# EAGLE design ShieldValvesSensor-v0 (EAGLE 9.6.2)
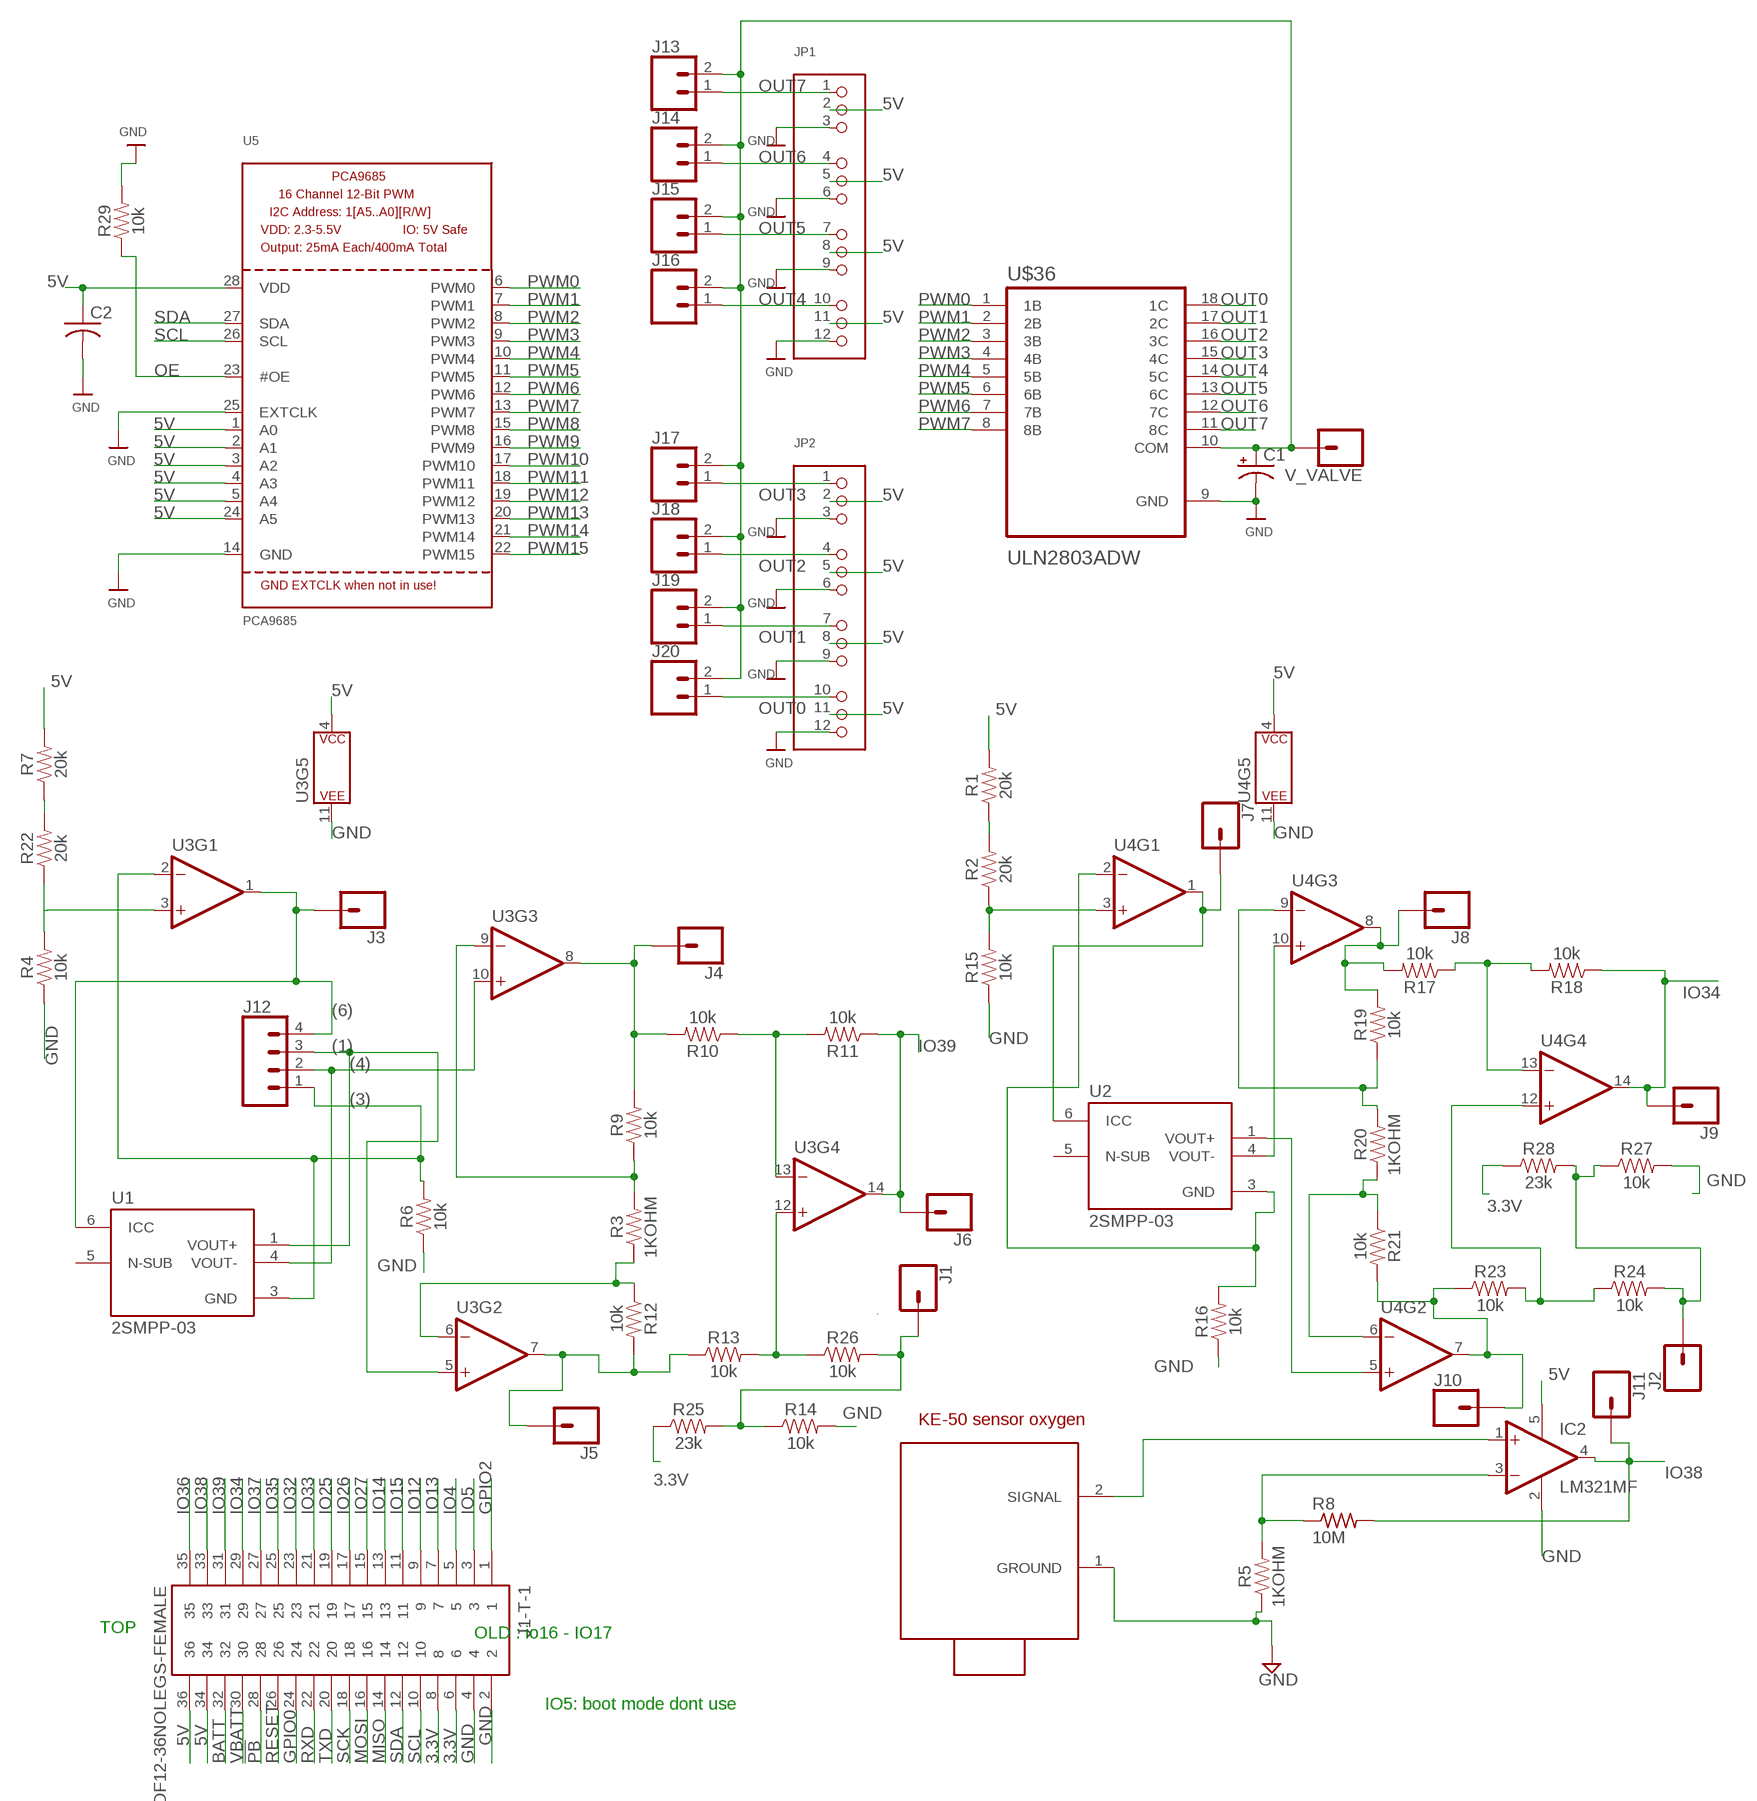
[diagram p0: schematic, sheet 1]

## Parts
C1  CPOL-USE2-4  [E2-4]
C2  C-USC0402  [C0402]
IC2  LM321MF  [SOT23-5]
J1  CONN_01  [1X01]
J1-T-1  DF12-36NOLEGS-FEMALE  [DF12-36-DP-NL]
J2  CONN_01  [1X01]
J3  CONN_01  [1X01]
J4  CONN_01  [1X01]
J5  CONN_01  [1X01]
J6  CONN_01  [1X01]
J7  CONN_01  [1X01]
J8  CONN_01  [1X01]
J9  CONN_01  [1X01]
J10  CONN_01  [1X01]
J11  CONN_01  [1X01]
J12  CONN_04PTH  [1X04]
J13  CONN_02  [1X02]
J14  CONN_02  [1X02]
J15  CONN_02  [1X02]
J16  CONN_02  [1X02]
J17  CONN_02  [1X02]
J18  CONN_02  [1X02]
J19  CONN_02  [1X02]
J20  CONN_02  [1X02]
JP1  HEADER-3X04  [3X04]
JP2  HEADER-3X04  [3X04]
R1  20k  20KOHM-0402T-1/16W-1%  [0402-TIGHT]
R2  20k  20KOHM-0402T-1/16W-1%  [0402-TIGHT]
R3  1KOHM  1KOHM-0402-1/16W-1%  [0402]
R4  10k  10KOHM-0402-1/16W-1%  [0402]
R5  1KOHM  1KOHM-0402-1/16W-1%  [0402]
R6  10k  10KOHM-0402-1/16W-1%  [0402]
R7  20k  20KOHM-0402T-1/16W-1%  [0402-TIGHT]
R8  10M  R-US_R0402  [R0402]
R9  10k  10KOHM-0402-1/16W-1%  [0402]
R10  10k  10KOHM-0402-1/16W-1%  [0402]
R11  10k  10KOHM-0402-1/16W-1%  [0402]
R12  10k  10KOHM-0402-1/16W-1%  [0402]
R13  10k  10KOHM-0402-1/16W-1%  [0402]
R14  10k  10KOHM-0402-1/16W-1%  [0402]
R15  10k  10KOHM-0402-1/16W-1%  [0402]
R16  10k  10KOHM-0402-1/16W-1%  [0402]
R17  10k  10KOHM-0402-1/16W-1%  [0402]
R18  10k  10KOHM-0402-1/16W-1%  [0402]
R19  10k  10KOHM-0402-1/16W-1%  [0402]
R20  1KOHM  1KOHM-0402-1/16W-1%  [0402]
R21  10k  10KOHM-0402-1/16W-1%  [0402]
R22  20k  20KOHM-0402T-1/16W-1%  [0402-TIGHT]
R23  10k  10KOHM-0402-1/16W-1%  [0402]
R24  10k  10KOHM-0402-1/16W-1%  [0402]
R25  23k  22KOHM-0402_TIGHT-1/10W-1%  [0402-TIGHT]
R26  10k  10KOHM-0402-1/16W-1%  [0402]
R27  10k  10KOHM-0402-1/16W-1%  [0402]
R28  23k  22KOHM-0402_TIGHT-1/10W-1%  [0402-TIGHT]
R29  10k  10KOHM-0402-1/16W-1%  [0402]
U1  2SMPP-03  [XDCR_2SMPP-03]
U2  2SMPP-03  [XDCR_2SMPP-03]
U3  LMV324SOP127P780X200-14N  [SOP127P780X200-14N]
U4  LMV324SOP127P780X200-14N  [SOP127P780X200-14N]
U5  PCA9685  [TSSOP28]
U$5  KE-50  [KE]
U$36  ULN2803ADW  [SOIC127P1030X265-18N]
V_VALVE  CONN_01  [1X01]

## Nets
3.3V [pcbway_smallest]: J1-T-1.6 J1-T-1.8 R25.1 R28.1
5V: C2.1 IC2.5(V+) J1-T-1.34 J1-T-1.36 JP1.2 JP1.5 JP1.8 JP1.11 JP2.2 JP2.5 JP2.8 JP2.11 R1.2 R7.2 U3.4(P$V+) U4.4(P$V+) U5.1(A0) U5.2(A1) U5.3(A2) U5.4(A3) U5.5(A4) U5.24(A5) U5.28(VDD)
!PB! [pcbway_smallest]: J1-T-1.28
(1): J12.3 U1.1(VOUT+) U3.5(+IN)
(3): J12.1 R6.2 U1.3(GND) U3.2(-IN)
(4): J12.2 U1.4(VOUT-) U3.10(+IN)
(6): J3.1 J12.4 U1.6(ICC) U3.1(OUT)
+IND2: R2.1 R15.2
-INA: R10.1 R11.2
-INC2: R19.1 R20.2 U4.9(-IN)
-IND2: R16.2 U2.3(GND) U4.2(-IN)
BATT: J1-T-1.32
GND: C1.- C2.2 IC2.2(V-) J1-T-1.2 J1-T-1.4 JP1.3 JP1.6 JP1.9 JP1.12 JP2.3 JP2.6 JP2.9 JP2.12 R4.1 R5.1 R6.1 R14.2 R15.1 R16.1 R27.2 R29.2 U3.11(P$V-) U4.11(P$V-) U5.14(GND) U5.25(EXTCLK) U$5.1(GROUND) U$36.9(GND)
GPIO0 [pcbway_smallest]: J1-T-1.24
GPIO2 [pcbway_smallest]: J1-T-1.1
IO4 [pcbway_smallest]: J1-T-1.5
IO5: J1-T-1.3
IO12 [pcbway_smallest]: J1-T-1.9
IO13 [pcbway_smallest]: J1-T-1.7
IO14 [pcbway_smallest]: J1-T-1.13
IO15 [pcbway_smallest]: J1-T-1.11
IO25 [pcbway_smallest]: J1-T-1.19
IO26 [pcbway_smallest]: J1-T-1.17
IO27 [pcbway_smallest]: J1-T-1.15
IO32 [pcbway_smallest]: J1-T-1.23
IO33 [pcbway_smallest]: J1-T-1.21
IO34 [pcbway_smallest]: J1-T-1.29 J9.1 R18.1 U4.14(OUT)
IO35 [pcbway_smallest]: J1-T-1.25
IO36 [pcbway_smallest]: J1-T-1.35
IO37 [pcbway_smallest]: J1-T-1.27
IO38 [pcbway_smallest]: IC2.4(OUT) J1-T-1.33 J11.1 R8.2
IO39 [pcbway_smallest]: J1-T-1.31 J6.1 R11.1 U3.14(OUT)
MISO [pcbway_smallest]: J1-T-1.14
MOSI [pcbway_smallest]: J1-T-1.16
N$1: IC2.3(-IN) R5.2 R8.1
N$2: IC2.1(+IN) U$5.2(SIGNAL)
N$3: R7.1 R22.2
N$4: R1.1 R2.2
N$6: R4.2 R22.1 U3.3(+IN)
N$9: R3.2 R9.1 U3.9(-IN)
N$10: J4.1 R9.2 R10.2 U3.8(OUT)
N$11: J5.1 R12.2 R13.1 U3.7(OUT)
N$12: U3.13(-IN)
N$14: R3.1 R12.1 U3.6(-IN)
N$15: R13.2 R26.1 U3.12(+IN)
N$16: J1.1 R14.1 R25.2 R26.2
N$17: U4.3(+IN)
N$19: J7.1 U2.6(ICC) U4.1(OUT)
N$20: U2.4(VOUT-) U4.10(+IN)
N$21: R17.1 R18.2 U4.13(-IN)
N$22: J8.1 R17.2 R19.2 U4.8(OUT)
N$23: U2.1(VOUT+) U4.5(+IN)
N$24: R20.1 R21.1 U4.6(-IN)
N$25: R23.2 R24.1 U4.12(+IN)
N$26: J10.1 R21.2 R23.1 U4.7(OUT)
N$28: J2.1 R24.2 R27.1 R28.2
OE: R29.1 U5.23(#OE)
OUT0: J20.1 JP2.10 U$36.18(1C)
OUT1: J19.1 JP2.7 U$36.17(2C)
OUT2: J18.1 JP2.4 U$36.16(3C)
OUT3: J17.1 JP2.1 U$36.15(4C)
OUT4: J16.1 JP1.10 U$36.14(5C)
OUT5: J15.1 JP1.7 U$36.13(6C)
OUT6: J14.1 JP1.4 U$36.12(7C)
OUT7: J13.1 JP1.1 U$36.11(8C)
OUT8: C1.+ J13.2 J14.2 J15.2 J16.2 J17.2 J18.2 J19.2 J20.2 U$36.10(COM) V_VALVE.1
PWM0: U5.6(PWM0) U$36.1(1B)
PWM1: U5.7(PWM1) U$36.2(2B)
PWM2: U5.8(PWM2) U$36.3(3B)
PWM3: U5.9(PWM3) U$36.4(4B)
PWM4: U5.10(PWM4) U$36.5(5B)
PWM5: U5.11(PWM5) U$36.6(6B)
PWM6: U5.12(PWM6) U$36.7(7B)
PWM7: U5.13(PWM7) U$36.8(8B)
PWM8: U5.15(PWM8)
PWM9: U5.16(PWM9)
PWM10: U5.17(PWM10)
PWM11: U5.18(PWM11)
PWM12: U5.19(PWM12)
PWM13: U5.20(PWM13)
PWM14: U5.21(PWM14)
PWM15: U5.22(PWM15)
RESET [pcbway_smallest]: J1-T-1.26
RXD [pcbway_smallest]: J1-T-1.22
SCK [pcbway_smallest]: J1-T-1.18
SCL [pcbway_smallest]: J1-T-1.10 U5.26(SCL)
SDA [pcbway_smallest]: J1-T-1.12 U5.27(SDA)
TXD [pcbway_smallest]: J1-T-1.20
VBATT [pcbway_smallest]: J1-T-1.30
Unconnected: U1.5(N-SUB) U2.5(N-SUB)

## Notes on the sheet
- TOP
- OLD : io16 - IO17
- IO5: boot mode dont use

## Library data of the parts
C1 = adafruit:CPOL-US: POLARIZED CAPACITOR, American symbol
C2 = adafruit:C-US: CAPACITOR, American symbol
IC2 = linear:LM321?*: Low Power Single Op Amp Source: http://cache.national.com/ds/LM/LM321.pdf
J1-J11 V_VALVE = SparkFun-Connectors:CONN_01: Single connection point. Often used as Generic Header-pin footprint for 0.1 inch spaced/style header connections On any of the 0.1 inch spaced packages, you can populate with these: Break Away Headers - Straight <https://www.sparkfun.com/products/116> (PRT-00116) Break Away Male Headers - Right Angle <https://www.sparkfun.com/products/553> (PRT-00553) Female Headers <https://www.sparkfun.com/products/115> (PRT-00115) Break Away Headers - Machine Pin <https://www.sparkfun.com/products/117> (PRT-00117) Break Away Female Headers - Swiss Machine Pin <https://www.sparkfun.com/products/743> (PRT-00743) This device is also useful as a general connection point to wire up your design to another part of your project. Our various solder wires solder well into these plated through hole pads. Hook-Up Wire - Assortment (Stranded, 22 AWG) <https://www.sparkfun.com/products/11375> (PRT-11375) Hook-Up Wire - Assortment (Solid Core, 22 AWG) <https://www.sparkfun.com/products/11367> (PRT-11367) View the entire wire category on our website here <https://www.sparkfun.com/categories/141> Special notes: SMTSO-256-ET is a "flush mount" nut for a 4-40 screw. We mostly use this on specialty testbeds; it is a nice way to connect hardware to your PCB at an adjustable hieght. Also note, the SNAP packages are for using a snappable style connector. We sell a baggie of snaps and they are also used on two LilyPad designs: Snap Assortment - 30 pack (male and female) <https://www.sparkfun.com/products/11347> (DEV-11347) LilyPad Arduino SimpleSnap <https://www.sparkfun.com/products/10941> (DEV-10941) LilyPad SimpleSnap Protoboard <https://www.sparkfun.com/products/10940> (DEV-10940)
J1-T-1 = movuino:DF12-36: CONN HEADER 32POS 3MM SMD 0.5MM
J12 = SparkFun-Connectors:CONN_04: Multi connection point. Often used as Generic Header-pin footprint for 0.1 inch spaced/style header connections On any of the 0.1 inch spaced packages, you can populate with these: Break Away Headers - Straight <https://www.sparkfun.com/products/116> (PRT-00116) Break Away Male Headers - Right Angle <https://www.sparkfun.com/products/553> (PRT-00553) Female Headers <https://www.sparkfun.com/products/115> (PRT-00115) Break Away Headers - Machine Pin <https://www.sparkfun.com/products/117> (PRT-00117) Break Away Female Headers - Swiss Machine Pin <https://www.sparkfun.com/products/743> (PRT-00743) For SCREWTERMINALS and SPRING TERMINALS visit here: Screw Terimnals on SparkFun.com <https://www.sparkfun.com/search/results?term=Screw+Terminals> (5mm/3.5mm/2.54mm spacing) This device is also useful as a general connection point to wire up your design to another part of your project. Our various solder wires solder well into these plated through hole pads. Hook-Up Wire - Assortment (Stranded, 22 AWG) <https://www.sparkfun.com/products/11375> (PRT-11375) Hook-Up Wire - Assortment (Solid Core, 22 AWG) <https://www.sparkfun.com/products/11367> (PRT-11367) View the entire wire category on our website here <https://www.sparkfun.com/categories/141> Special notes: Molex polarized connector foot print use with SKU : PRT-08231 with associated crimp pins and housings. 1MM SMD Version SKU: PRT-10208; PROD_ID: CONN-09696
J13-J20 = SparkFun-Connectors:CONN_02: Multi connection point. Often used as Generic Header-pin footprint for 0.1 inch spaced/style header connections On any of the 0.1 inch spaced packages, you can populate with these: Break Away Headers - Straight <https://www.sparkfun.com/products/116> (PRT-00116) Break Away Male Headers - Right Angle <https://www.sparkfun.com/products/553> (PRT-00553) Female Headers <https://www.sparkfun.com/products/115> (PRT-00115) Break Away Headers - Machine Pin <https://www.sparkfun.com/products/117> (PRT-00117) Break Away Female Headers - Swiss Machine Pin <https://www.sparkfun.com/products/743> (PRT-00743) For SCREWTERMINALS and SPRING TERMINALS visit here: Screw Terimnals on SparkFun.com <https://www.sparkfun.com/search/results?term=Screw+Terminals> (5mm/3.5mm/2.54mm spacing) This device is also useful as a general connection point to wire up your design to another part of your project. Our various solder wires solder well into these plated through hole pads. Hook-Up Wire - Assortment (Stranded, 22 AWG) <https://www.sparkfun.com/products/11375> (PRT-11375) Hook-Up Wire - Assortment (Solid Core, 22 AWG) <https://www.sparkfun.com/products/11367> (PRT-11367) View the entire wire category on our website here <https://www.sparkfun.com/categories/141> Special notes: Molex polarized connector foot print use with: PRT-08233 with associated crimp pins and housings. 2.54_SCREWTERM for use with PRT-10571. 3.5mm Screw Terminal footprints for PRT-08084 5mm Screw Terminal footprints for use with PRT-08432
JP1 JP2 = microbuilder:HEADER-3X04
R1 R2 R7 R22 = SparkFun-Resistors:20KOHM: 20kΩ resistor A resistor is a passive two-terminal electrical component that implements electrical resistance as a circuit element. Resistors act to reduce current flow, and, at the same time, act to lower voltage levels within circuits. - Wikipedia; PROD_ID: RES-15131
R3 R5 R20 = SparkFun-Resistors:1KOHM: 1kΩ resistor A resistor is a passive two-terminal electrical component that implements electrical resistance as a circuit element. Resistors act to reduce current flow, and, at the same time, act to lower voltage levels within circuits. - Wikipedia; PROD_ID: RES-14342
R4 R6 R9-R19 R21 R23 R24 R26 R27 R29 = SparkFun-Resistors:10KOHM: 10kΩ resistor A resistor is a passive two-terminal electrical component that implements electrical resistance as a circuit element. Resistors act to reduce current flow, and, at the same time, act to lower voltage levels within circuits. - Wikipedia; PROD_ID: RES-14241
R8 = adafruit:R-US_: RESISTOR, American symbol
R25 R28 = SparkFun-Resistors:22KOHM: 22kΩ resistor A resistor is a passive two-terminal electrical component that implements electrical resistance as a circuit element. Resistors act to reduce current flow, and, at the same time, act to lower voltage levels within circuits. - Wikipedia; PROD_ID: RES-14281; VALUE: 22k
U1 U2 = 2SMPP-03:2SMPP-03: Sensor: pressure; Range: -50÷50kPa; referential; -10÷85°C Check prices <https://pricing.snapeda.com/parts/2SMPP-03/Omron%20Electronics/view-part?ref=eda>; AVAILABILITY: Warning; DESCRIPTION: Pressure Sensor ±7.25PSI (±50kPa) Compound Male - 0.1 (2.59mm) Tube -43 mV ~ 42 mV 6-SMD Module; MF: Omron Electronics; MP: 2SMPP-03; PACKAGE: SOP-6 Omron; PRICE: None
U3 U4 = LM324AN:LMV324: IC LMV324 Quad Op Amp Jellybean quad op-amp Datasheet <http://cdn.sparkfun.com/datasheets/Sensors/Sound/LMV324.pdf> SparkFun Products SparkFun Sensor Kit <https://www.sparkfun.com/products/13754> (DEV-13754) SparkFun Inventor's Kit for Arduino 101 <https://www.sparkfun.com/products/13844> (KIT-13844) SparkFun Sound Detector <https://www.sparkfun.com/products/12642> (SEN-12642)
U5 = microbuilder:PCA9685: PCA9685 - 16 Channel 12-Bit I2C PWM Controller 5.0V tolerant 16 channel, 12-bit I2C PWM controller with 25mA per output (max. 400mA total) Digikey: 568-5931-1-ND
U$5 = KE O2 Sensor:KE-50
U$36 = ULN2803ADW:ULN2803ADW

## Net classes
1 pcbway_smallest: width 0.102 mm, drill 0.2 mm, clearance 0.102 mm

## Board
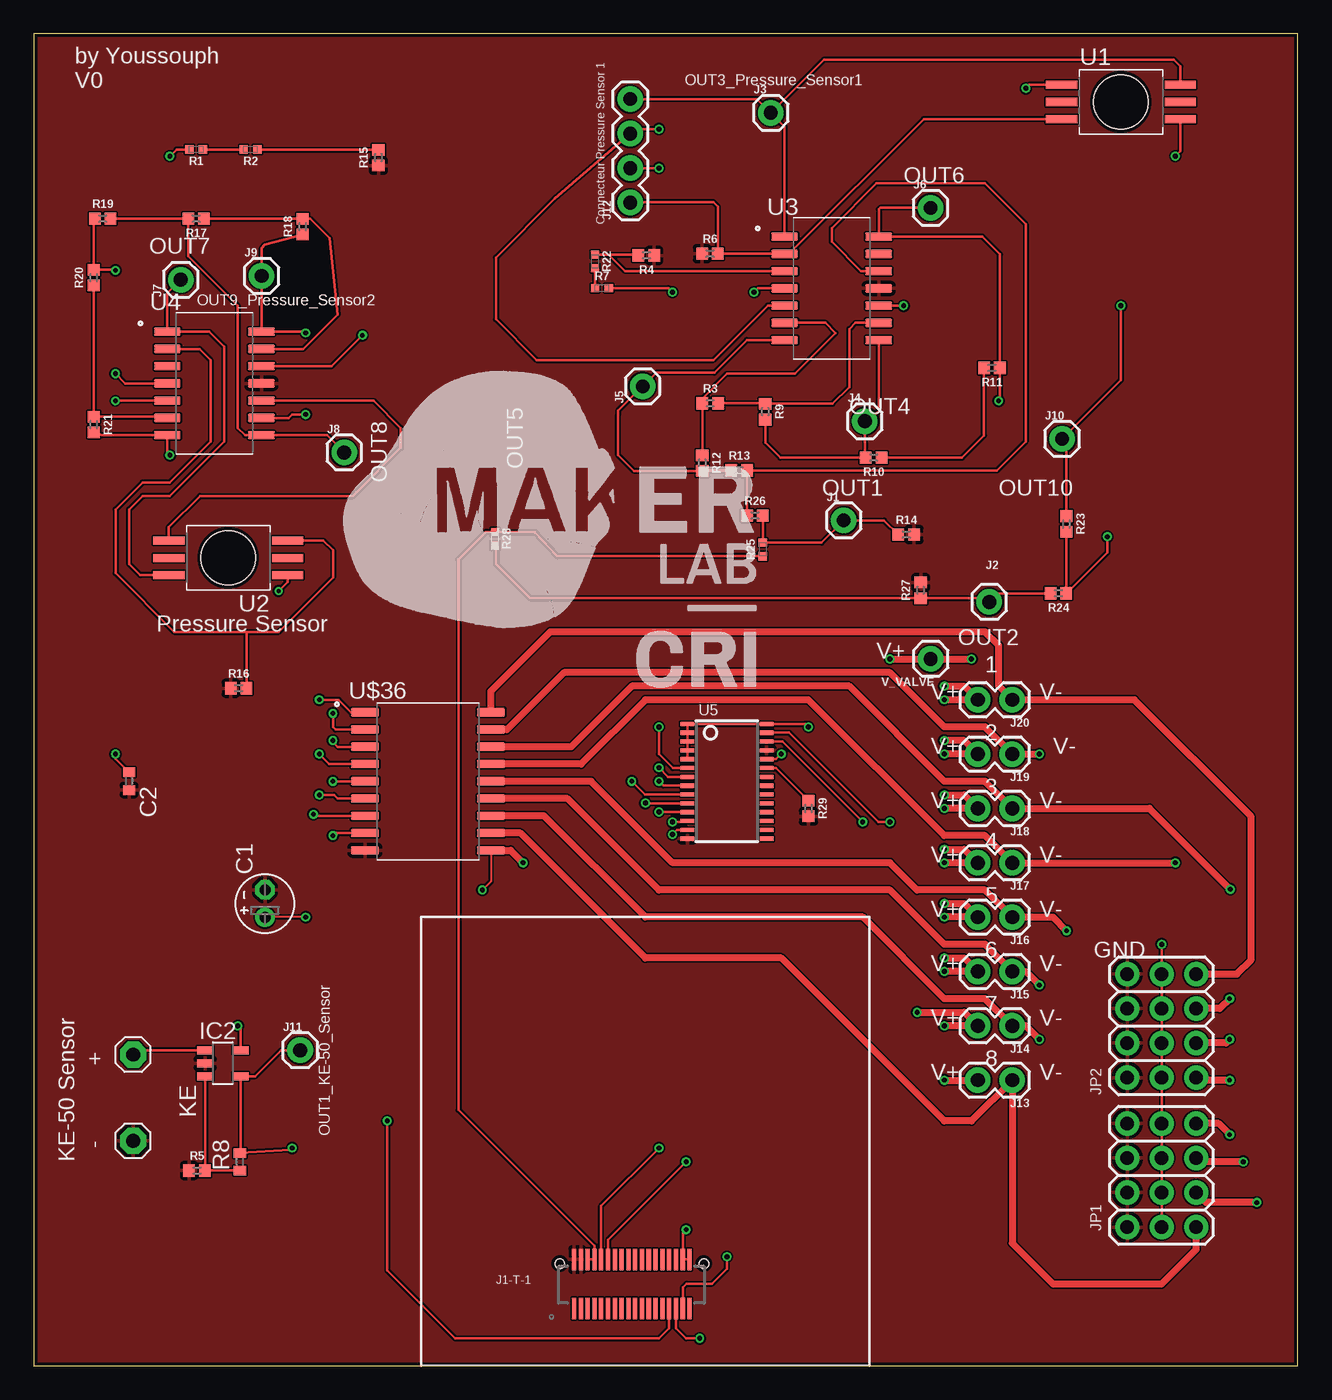
[diagram p1: board, top side]
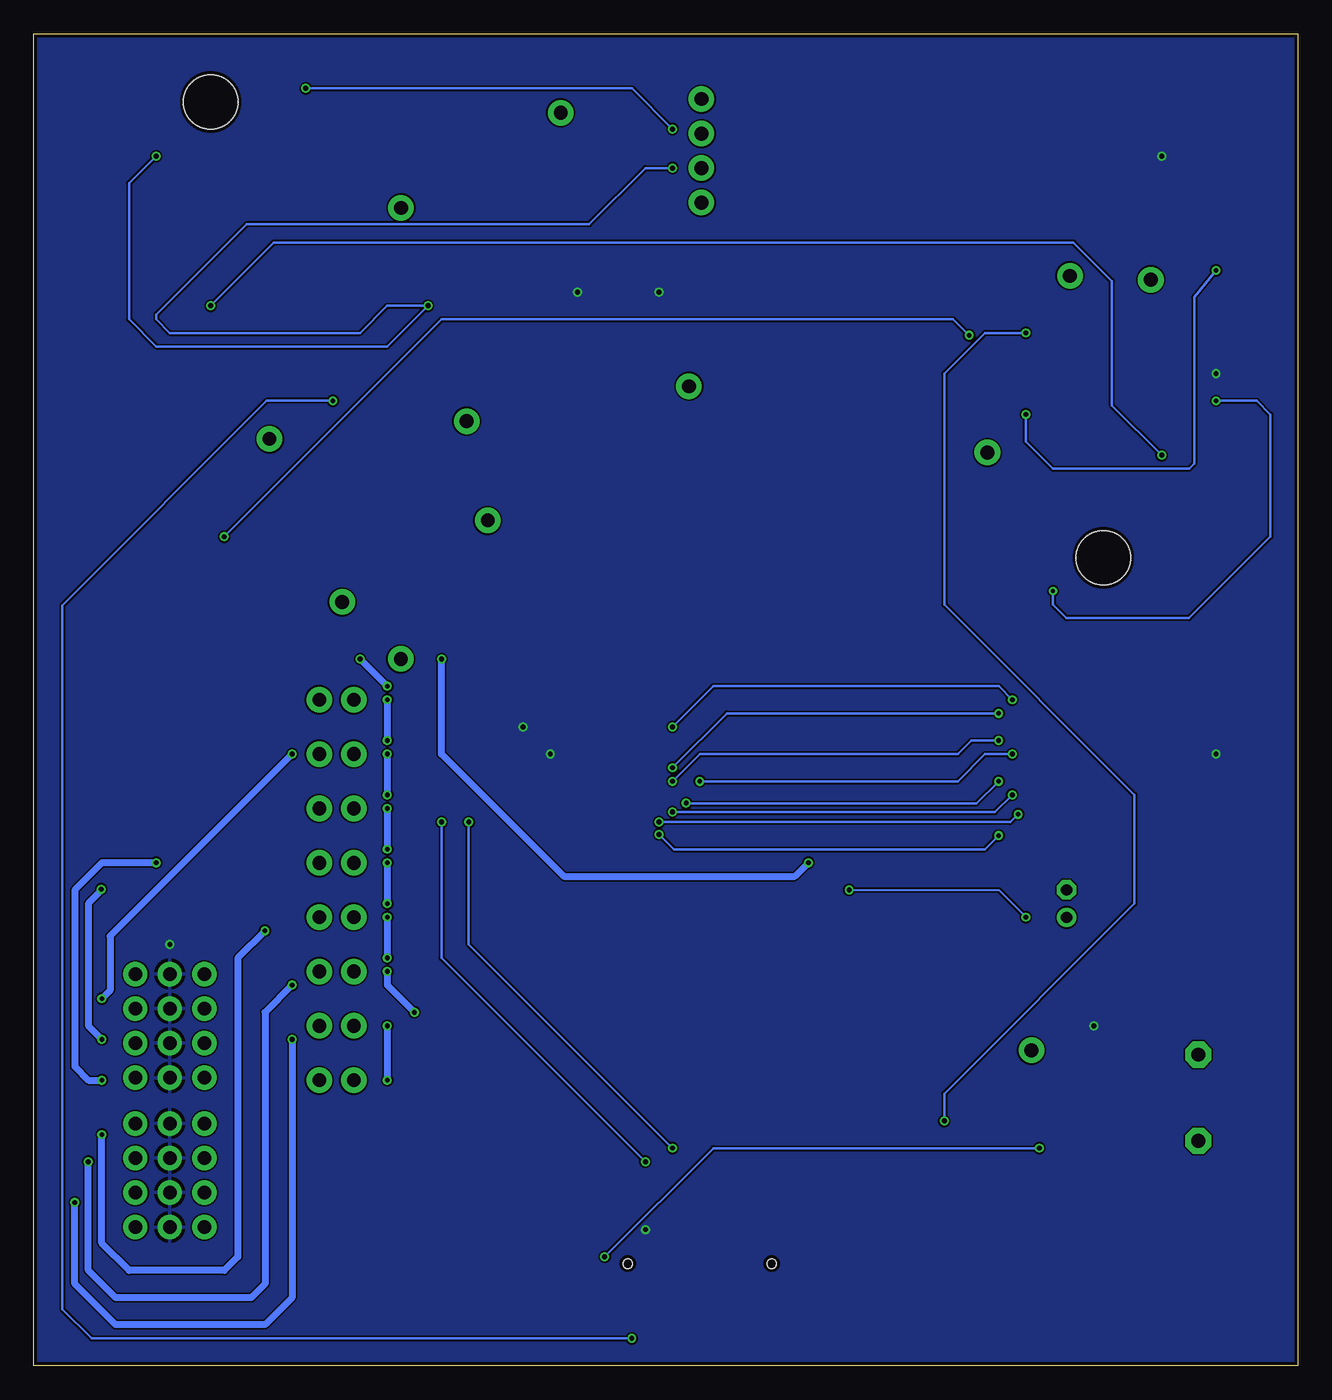
[diagram p2: board, bottom side, seen from below]

Size 93 x 98 mm. Coordinates in mm from the lower left corner, seen from the top.
Outline: 0,0 93,0 93,98 0,98 0,0
Copper layers (1*16): Top 0.035mm / dielectric 1.5mm / Bottom 0.035mm
Design rules "JLCPCB_2layer_DRU_no_angle_5mil": minimum track width 5mil, minimum drill 0.3mm, track to track 5mil, track to pad 5mil, pad to pad 5mil, via to via 5mil, smd to smd 0mil, copper to edge 10mil, drill to drill 10mil, minimum pad ring 10mil, minimum via ring 6mil, stop-mask expansion 2mil, vias tented up to drill 100mil, thermal gap 10mil

### Footprints (pad centres in the part's own frame; a part is rotated, then mirrored left to right if it is on the bottom)
E2-4 = drill 0.813 pad 1.422: + -1.016,0 | drill 0.813 pad 1.422 octagon: - 1.016,0
C0402 = smd 0.7 x 0.9: 1 -0.65,0; 2 0.65,0
SOT23-5 = smd 0.6 x 1.2: 1 -0.95,-1.306; 2 0,-1.306; 3 0.95,-1.306; 4 0.95,1.306; 5 -0.95,1.306
1X01 = drill 1.016 pad 1.88: 1 0,0
DF12-36-DP-NL = smd 0.3 x 1.6: 1 -4.25,-1.8; 2 -4.25,1.8; 3 -3.75,-1.8; 4 -3.75,1.8; 5 -3.25,-1.8; 6 -3.25,1.8; 7 -2.75,-1.8; 8 -2.75,1.8; 9 -2.25,-1.8; 10 -2.25,1.8; 11 -1.75,-1.8; 12 -1.75,1.8; 13 -1.25,-1.8; 14 -1.25,1.8; 15 -0.75,-1.8; 16 -0.75,1.8; 17 -0.25,-1.8; 18 -0.25,1.8; 19 0.25,-1.8; 20 0.25,1.8; 21 0.75,-1.8; 22 0.75,1.8; 23 1.25,-1.8; 24 1.25,1.8; 25 1.75,-1.8; 26 1.75,1.8; 27 2.25,-1.8; 28 2.25,1.8; 29 2.75,-1.8; 30 2.75,1.8; 31 3.25,-1.8; 32 3.25,1.8; 33 3.75,-1.8; 34 3.75,1.8; 35 4.25,-1.8; 36 4.25,1.8 | hole 0.7: -5.3,1.5; 5.3,1.5
1X04 = drill 1.016 pad 1.88: 1 0,0; 2 2.54,0; 3 5.08,0; 4 7.62,0
1X02 = drill 1.016 pad 1.88: 1 0,0; 2 2.54,0
3X04 = drill 1 pad 1.778: 1 -3.81,-2.54; 2 -3.81,0; 3 -3.81,2.54; 4 -1.27,-2.54; 5 -1.27,0; 6 -1.27,2.54; 7 1.27,-2.54; 8 1.27,0; 9 1.27,2.54; 10 3.81,-2.54; 11 3.81,0; 12 3.81,2.54
0402-TIGHT = smd 0.6 x 0.6: 1 -0.5,0; 2 0.5,0
0402 = smd 0.85 x 0.9: 1 -0.58,0; 2 0.58,0
R0402 = smd 0.7 x 0.9: 1 -0.65,0; 2 0.65,0
XDCR_2SMPP-03 = smd 2.3 x 0.6: 1 -4.375,1.27; 2 -4.375,0; 3 -4.375,-1.27; 4 4.375,-1.27; 5 4.375,0; 6 4.375,1.27 | hole 4: 0,0
SOP127P780X200-14N = smd 1.97 x 0.61: 1 -3.465,3.81; 2 -3.465,2.54; 3 -3.465,1.27; 4 -3.465,0; 5 -3.465,-1.27; 6 -3.465,-2.54; 7 -3.465,-3.81; 8 3.465,-3.81; 9 3.465,-2.54; 10 3.465,-1.27; 11 3.465,0; 12 3.465,1.27; 13 3.465,2.54; 14 3.465,3.81
TSSOP28 = smd 0.305 x 0.991: 1 -4.225,-2.918; 2 -3.575,-2.918; 3 -2.925,-2.918; 4 -2.275,-2.918; 5 -1.625,-2.918; 6 -0.975,-2.918; 7 -0.325,-2.918; 8 0.325,-2.918; 9 0.975,-2.918; 10 1.625,-2.918; 11 2.275,-2.918; 12 2.925,-2.918; 13 3.575,-2.918; 14 4.225,-2.918; 15 4.225,2.918; 16 3.575,2.918; 17 2.925,2.918; 18 2.275,2.918; 19 1.625,2.918; 20 0.975,2.918; 21 0.325,2.918; 22 -0.325,2.918; 23 -0.975,2.918; 24 -1.625,2.918; 25 -2.275,2.918; 26 -2.925,2.918; 27 -3.575,2.918; 28 -4.225,2.918
KE = drill 1.016 pad 1.93 octagon: 1 2.81,-0.27; 2 -3.54,-0.27
SOIC127P1030X265-18N = smd 2.06 x 0.6: 1 -4.64,5.08; 2 -4.64,3.81; 3 -4.64,2.54; 4 -4.64,1.27; 5 -4.64,0; 6 -4.64,-1.27; 7 -4.64,-2.54; 8 -4.64,-3.81; 9 -4.64,-5.08; 10 4.64,-5.08; 11 4.64,-3.81; 12 4.64,-2.54; 13 4.64,-1.27; 14 4.64,0; 15 4.64,1.27; 16 4.64,2.54; 17 4.64,3.81; 18 4.64,5.08

### Placement (x,y rotation side)
C1  17,34 90 top
C2  7,43 270 top
IC2  13.9,22.24 270 top
J1  59.6,62.2 0 top
J1-T-1  44,6 0 top
J2  70.31,56.2 0 top
J3  54.23,92.2 0 top
J4  61.15,69.5 0 top
J5  44.8,72.07 90 top
J6  65.99,85.2 0 top
J7  10.8,79.91 90 top
J8  22.83,67.2 0 top
J9  16.75,80.2 0 top
J10  75.67,68.2 0 top
J11  19.59,23.2 0 top
J12  43.88,85.59 90 top
J13  72,21 180 top
J14  72,25 180 top
J15  72,29 180 top
J16  72,33 180 top
J17  72,37 180 top
J18  72,41 180 top
J19  72,45 180 top
J20  72,49 180 top
JP1  83,14 90 top
JP2  83,25 90 top
R1  11.94,89.5 180 top
R2  15.94,89.5 180 top
R3  49.77,70.82 0 top
R4  45.07,81.7 180 top
R5  12,14.35 0 top
R6  49.75,81.83 0 top
R7  41.8,79.3 0 top
R8  15.15,15 90 top
R9  53.82,70.2 270 top
R10  61.8,66.82 180 top
R11  70.51,73.42 180 top
R12  49.18,66.42 270 top
R13  51.9,65.88 0 top
R14  64.2,61.15 0 top
R15  25.35,88.9 90 top
R16  15.06,49.84 0 top
R17  11.94,84.4 180 top
R18  19.78,83.82 90 top
R19  5.06,84.41 0 top
R20  4.4,80.06 90 top
R21  4.4,69.25 270 top
R22  41.3,81.26 270 top
R23  75.98,61.94 270 top
R24  75.4,56.83 180 top
R25  53.64,60.06 90 top
R26  53.06,62.55 0 top
R27  65.26,57.06 90 top
R28  33.93,60.85 270 top
R29  57,41 270 top
U1  80,93 0 top
U2  14.3,59.44 180 top
U3  58.71,79.28 0 top
U4  13.28,72.28 0 top
U5  51,43 270 top
U$5  7.57,19.34 270 top
U$36  29,43 0 top
V_VALVE  66,52 180 top

### Tracks (layer width: path | path; a pad name or v marks a point on that pad's centre or on a via)
3.3V
  Top 0.2: R25.1 38.5,59.56 36.85,61.35 R28.1 33.25,61.35 31.25,59.35 31.25,18.8 41.25,8.8 J1-T-1.8 J1-T-1.6
5V  (via drill 0.35, 0.35 pad 0.6)
  Top 0.2: IC2.5 15.21,24.79 v15,25 | U4.4 6.72,72.28 v6,73 | R1.2 10.5,89.5 v10,89 | R7.2 46.7,79.3 v47,79 | U3.4 53.28,79.28 v53,79 | v48,10 47.75,9.75 J1-T-1.34 J1-T-1.36 | C2.1 6,44.65 v6,45 | v57,47 56.77,47.23 U5.28 U5.1 U5.2 | U5.24 54.62,44.62 v55,45 | JP1.2 JP1.5 JP1.8 JP1.11 JP2.2 JP2.5 JP2.8 JP2.11 v83,31 | U5.2 U5.5 U5.4 | U5.3 U5.2
  pour Bottom: 0,98 93,98 93,0 0,0
(1)  (via drill 0.35)
  Top 0.2: U3.5 54.01,78.01 50,74 37,74 34,77 34,81.55 38.33,85.88 J12.3 44.21,91 v46,91 | U1.1 73.27,94.27 v73,94
  Bottom 0.2: v73,94 49,94 v46,91
(3)
  Top 0.2: J12.1 44.66,85.63 50,85.63 50.33,85.3 R6.2 55.23,81.83 U3.2 55.58,81.82 65.49,91.73 U1.3
(4)  (via drill 0.35, 0.35 pad 0.6)
  Top 0.2: J12.2 v46,88.13 | U3.10 v63.99,78.01 v64,78 | U1.4 84.38,89.38 v84,89
  Bottom 0.2: v46,88.13 48,88.13 52.13,84 77.36,84 84,77.36 84,77 83,76 69,76 67,78 v64,78 67,75 84,75 86,77 86,87 v84,89
(6)
  Top 0.2: J12.4 53.23,93.2 J3.1 | J3.1 55.24,91.19 U3.1 | U1.6 84.38,95.62 83.88,96.12 58.15,96.12 J3.1
+IND2
  Top 0.2: R2.1 25.33,89.5 R15.2
-INA
  Top 0.2: R11.2 69.93,68.45 68.3,66.82 R10.1
-INC2  (via drill 0.35 pad 0.6)
  Top 0.2: R19.1 4.4,84.33 R20.2 5.96,80.64 v6,80.6 | U4.9 18.75,69.74 19,70 v20,70
  Bottom 0.2: v20,70 20,68 18,66 7.97,66 7.61,66.37 7.61,78.62 v6,80.6
-IND2
  Top 0.2: U4.2 12.18,74.82 13,74 13,68 10,65 8,65 6,63 6,58.32 10.32,54 15.64,54 | 15.64,54 18,54 22,58 22,60 21.29,60.71 U2.3 | R16.2 15.64,54
GND
  pour Top: 93,0 0,0 0,98 93,98
IO34  (via drill 0.35)
  Top 0.2: R18.1 16.96,82.48 16.77,82.22 16.75,82.19 J9.1 U4.14 19.91,76.09 v20,76 | v26,18 26,7 31,2 46,2 46.75,2.75 J1-T-1.29
  Bottom 0.2: v20,76 23,76 26,73 26,56 12,42 12,34 26,20 v26,18
IO38  (via drill 0.35 pad 0.6)
  Top 0.2: v19,16 18.89,15.86 R8.2 15.21,15.71 IC2.4 16.29,21.29 18.2,23.2 J11.1 | J1-T-1.33 47.75,5.75 48.03,6.03 49.91,6.03 51,7.13 v51,8
  Bottom 0.2: v19,16 43,16 v51,8
IO39  (via drill 0.35 pad 0.6)
  Top 0.2: J6.1 62.28,85.2 62.17,85.09 U3.14 69.79,83.09 71.09,81.79 R11.1 71.09,71.09 v71,71 | v49,2 48,2 47.25,2.75 J1-T-1.31
  Bottom 0.2: v49,2 88.76,2 90.91,4.15 90.91,55.95 75.86,71 v71,71
N$1
  Top 0.2: R8.1 R5.2 12.59,14.36 IC2.3
N$2
  Top 0.2: IC2.1 7.61,23.19 U$5.2
N$3
  Top 0.2: R22.2 R7.1
N$4
  Top 0.2: R1.1 R2.2
N$6
  Top 0.2: U3.3 43.51,80.55 42.3,81.76 R22.1 44.43,81.76 R4.2
N$9
  Top 0.2: U3.9 60.46,76.74 60,76.28 60,72 58.78,70.78 R9.1 53.78,70.82 R3.2
N$10
  Top 0.2: U3.8 62.17,70.22 J4.1 61.15,66.89 R10.2 54.93,66.82 53.82,67.93 R9.2
N$11
  Top 0.2: R13.1 49.22,65.88 R12.2 44.16,65.84 43,67 43,70 43,70.27 J5.1 45.8,73.07 50.07,73.07 52.47,75.47 U3.7
N$14
  Top 0.2: R12.1 R3.1 49.19,71.18 51.01,73 56,73 59,76 58.26,76.74 U3.6
N$15
  Top 0.2: U3.12 60.88,80.55 58.71,82.71 58.71,83.71 62,87 70,87 73,84 73,68 70.88,65.88 R13.2 R26.1
N$16
  Top 0.2: R26.2 R25.2 57.96,60.56 J1.1 62.57,62.2 R14.1
N$19
  Top 0.2: J7.1 9.81,78.92 U4.1 12.91,76.09 14,75 14,68 10,64 8,64 7,63 7,59 7.83,58.17 U2.6
N$20
  Top 0.2: U2.4 9.93,61.71 12.21,64 23.46,64 23.75,64.29 27,67.54 27,69 24.99,71.01 19,71.01 U4.10
N$21
  Top 0.2: U4.13 19.82,74.82 22.35,77.35 21.74,82.97 20.32,84.4 20,84.4 R18.2 R17.1
N$22
  Top 0.2: J8.1 21.56,68.47 U4.8 15.53,68.47 15,69 15,78 11.36,81.64 R17.2 R19.2
N$23  (via drill 0.3 pad 0.6)
  Top 0.2: U4.5 v6.01,71.01 v6,71 | v18,57 18.68,57.67 U2.1
  Bottom 0.2: v6,71 3,71 2,70 2,61 8,55 17,55 18,56 v18,57
N$24
  Top 0.2: U4.6 9.72,69.83 R21.1 R20.1
N$25  (via drill 0.35 pad 0.6)
  Top 0.2: U4.12 21.9,73.55 v24.18,75.82 | R23.2 R24.1 79,59.85 v79,61
  Bottom 0.2: v79,61 63,77 25.35,77 v24.18,75.82
N$26  (via drill 0.35 pad 0.6)
  Top 0.2: v80,78 80,72.53 75.73,68.27 | 75.73,68.27 J10.1 | v10,67 9.81,67.19 U4.7 4.99,68.47 R21.2 | R23.1 75.98,68.02 75.73,68.27
  Bottom 0.2: v10,67 13.66,70.66 13.66,79.81 16.5,82.64 75.36,82.64 v80,78
N$28
  Top 0.2: R24.2 70.94,56.83 J2.1 70.31,56.48 R27.1 36.52,56.48 34,59 34,60.28 R28.2
OE
  Top 0.2: R29.1 54.6,43.98 U5.23
OUT0
  Top 0.5: U$36.18 33.64,49.64 38,54 70,54 71,53 71,50 J20.1 81,49 89.54,40.46 89.54,29.81 88.54,28.81 JP2.10
OUT1  (via drill 0.35)
  Top 0.5: U$36.17 34.81,46.81 39,51 63,51 67,47 70,47 J19.1 v74,45 | v88,27 87.27,26.27 JP2.7
  Bottom 0.5: v74,45 87.4,31.6 87.4,27.6 v88,27
OUT2  (via drill 0.35)
  Top 0.5: U$36.16 39.54,45.54 44,50 60,50 67,43 70,43 J18.1 82.1,41 v88.05,35.05 | v88,24 87.73,23.73 JP2.4
  Bottom 0.5: v88.05,35.05 88.05,34.95 89,34 89,25 v88,24
OUT3  (via drill 0.35)
  Top 0.5: U$36.15 40.27,44.27 45,49 57,49 67,39 70,39 J17.1 v84,37 | JP2.1 85.73,21 v88,21
  Bottom 0.5: v84,37 88,37 90,35 90,22 89,21 v88,21
OUT4  (via drill 0.35)
  Top 0.5: U$36.14 41,43 47,37 63,37 65,35 70,35 J16.1 75,33 v76,32 | v88,17 87.19,17.81 JP1.10
  Bottom 0.5: v76,32 78,30 78,8 79,7 86,7 88,9 v88,17
OUT5  (via drill 0.35)
  Top 0.5: U$36.13 39.27,41.73 46,35 63,35 67,31 70,31 J15.1 73,29 v74,28 | v89,15 85.81,15 JP1.7
  Bottom 0.5: v74,28 76,26 76,6 77,5 87,5 89,7 v89,15
OUT6  (via drill 0.35)
  Top 0.5: U$36.12 37.54,40.46 45,33 61,33 67,27 70,27 J14.1 73,25 v74,24 | v90,12 86.27,12 JP1.4
  Bottom 0.5: v74,24 74,5 76,3 87,3 90,6 v90,12
OUT7
  Top 0.5: U$36.11 35.81,39.19 45,30 55,30 67,18 69,18 J13.1 72,9 75,6 83,6 85.54,8.54 JP1.1
OUT8  (via drill 0.35)
  Top 0.152: U$36.10 33.64,35.64 v33,35 | v20,33 17.02,33 C1.+
  Top 0.5: U$36.10 35.08,37.92 v36,37 | v63,52 V_VALVE.1 v69,52 | v67,50 68.46,50 J20.2 v67,49 | v67,46 68.46,46 J19.2 v67,45 | v67,42 68.46,42 J18.2 v67,41 | v67,38 68.46,38 J17.2 v67,37 | v67,34 68.46,34 J16.2 v67,33 | v67,30 68.46,30 J15.2 v67,29 | v65,26 68.46,26 J14.2 v67,25 | v67,21 J13.2
  Bottom 0.152: v33,35 22,35 v20,33
  Bottom 0.5: v36,37 37,36 54,36 63,45 v63,52 | v69,52 v67,50 | v67,49 v67,46 | v67,45 v67,42 | v67,41 v67,38 | v67,37 v67,34 | v67,33 v67,30 | v67,29 67,28 v65,26 | v67,25 v67,21
PWM0  (via drill 0.35)
  Top 0.2: U5.6 47.02,43.98 46,45 v46,47 | U$36.1 23.36,48.08 22.44,49 v21,49
  Bottom 0.2: v46,47 43,50 22,50 v21,49
PWM1  (via drill 0.35)
  Top 0.2: U5.7 46.67,43.33 v46,44 | U$36.2 22.19,46.81 22,47 v22,48
  Bottom 0.2: v46,44 42,48 v22,48
PWM2  (via drill 0.35)
  Top 0.2: U5.8 46.33,42.67 v46,43 | v22,46 22,45.9 22.36,45.54 U$36.3
  Bottom 0.2: v46,43 44,45 25,45 24,46 v22,46
PWM3  (via drill 0.35)
  Top 0.2: U5.9 44.98,42.02 v44,43 | v21,45 21.73,44.27 U$36.4
  Bottom 0.2: v44,43 25,43 23,45 v21,45
PWM4  (via drill 0.35)
  Top 0.2: U5.10 45.02,41.38 v45,41.39 | v22,43 U$36.5
  Bottom 0.2: v45,41.39 45,41.37 23.63,41.37 v22,43
PWM5  (via drill 0.35)
  Top 0.2: U5.11 46.01,40.73 v46,40.74 | v21,42 22.09,42 22.36,41.73 U$36.6
  Bottom 0.2: v46,40.74 22.26,40.74 v21,42
PWM6  (via drill 0.35)
  Top 0.2: U$36.7 20.68,40.46 v20.57,40.57 | v47,40 48.01,40 U5.12
  Bottom 0.2: v20.57,40.57 21.14,40 v47,40
PWM7  (via drill 0.35)
  Top 0.2: U5.13 47.33,39.42 v47,39.09 | v22,39 22.19,39.19 U$36.8
  Bottom 0.2: v47,39.09 45.91,38 23,38 v22,39
SCL  (via drill 0.35)
  Top 0.2: J1-T-1.10 41.75,11.75 v46,16 | v61,40 55.08,45.92 U5.26
  Bottom 0.2: v46,16 61,31 v61,40
SDA  (via drill 0.35)
  Top 0.2: U5.27 55.57,46.58 62.14,40 v63,40 | v48,15 42.25,9.25 J1-T-1.12
  Bottom 0.2: v63,40 63,30 v48,15

### Text on the board
tPlace: OUT3_Pressure_Sensor1 | by Youssouph / V0 | OUT6 | Connecteur Pressure Sensor 1 | OUT7 | OUT9_Pressure_Sensor2 | OUT4 | OUT5 | OUT8 | OUT1 | OUT10 | Pressure Sensor | OUT2 | V+ | 1 | V+ | V- | 2 | V+ | V- | 3 | V+ | V- | 4 | V+ | V- | 5 | V+ | V- | 6 | GND | V+ | V- | OUT1_KE-50_Sensor | 7 | V+ | V- | + | 8 | V+ | V- | - | KE-50 Sensor